# EAGLE design Sensor_Board_0x08_Dual_Temperatures_2xDS18B20_v1 (EAGLE 8.4.3)
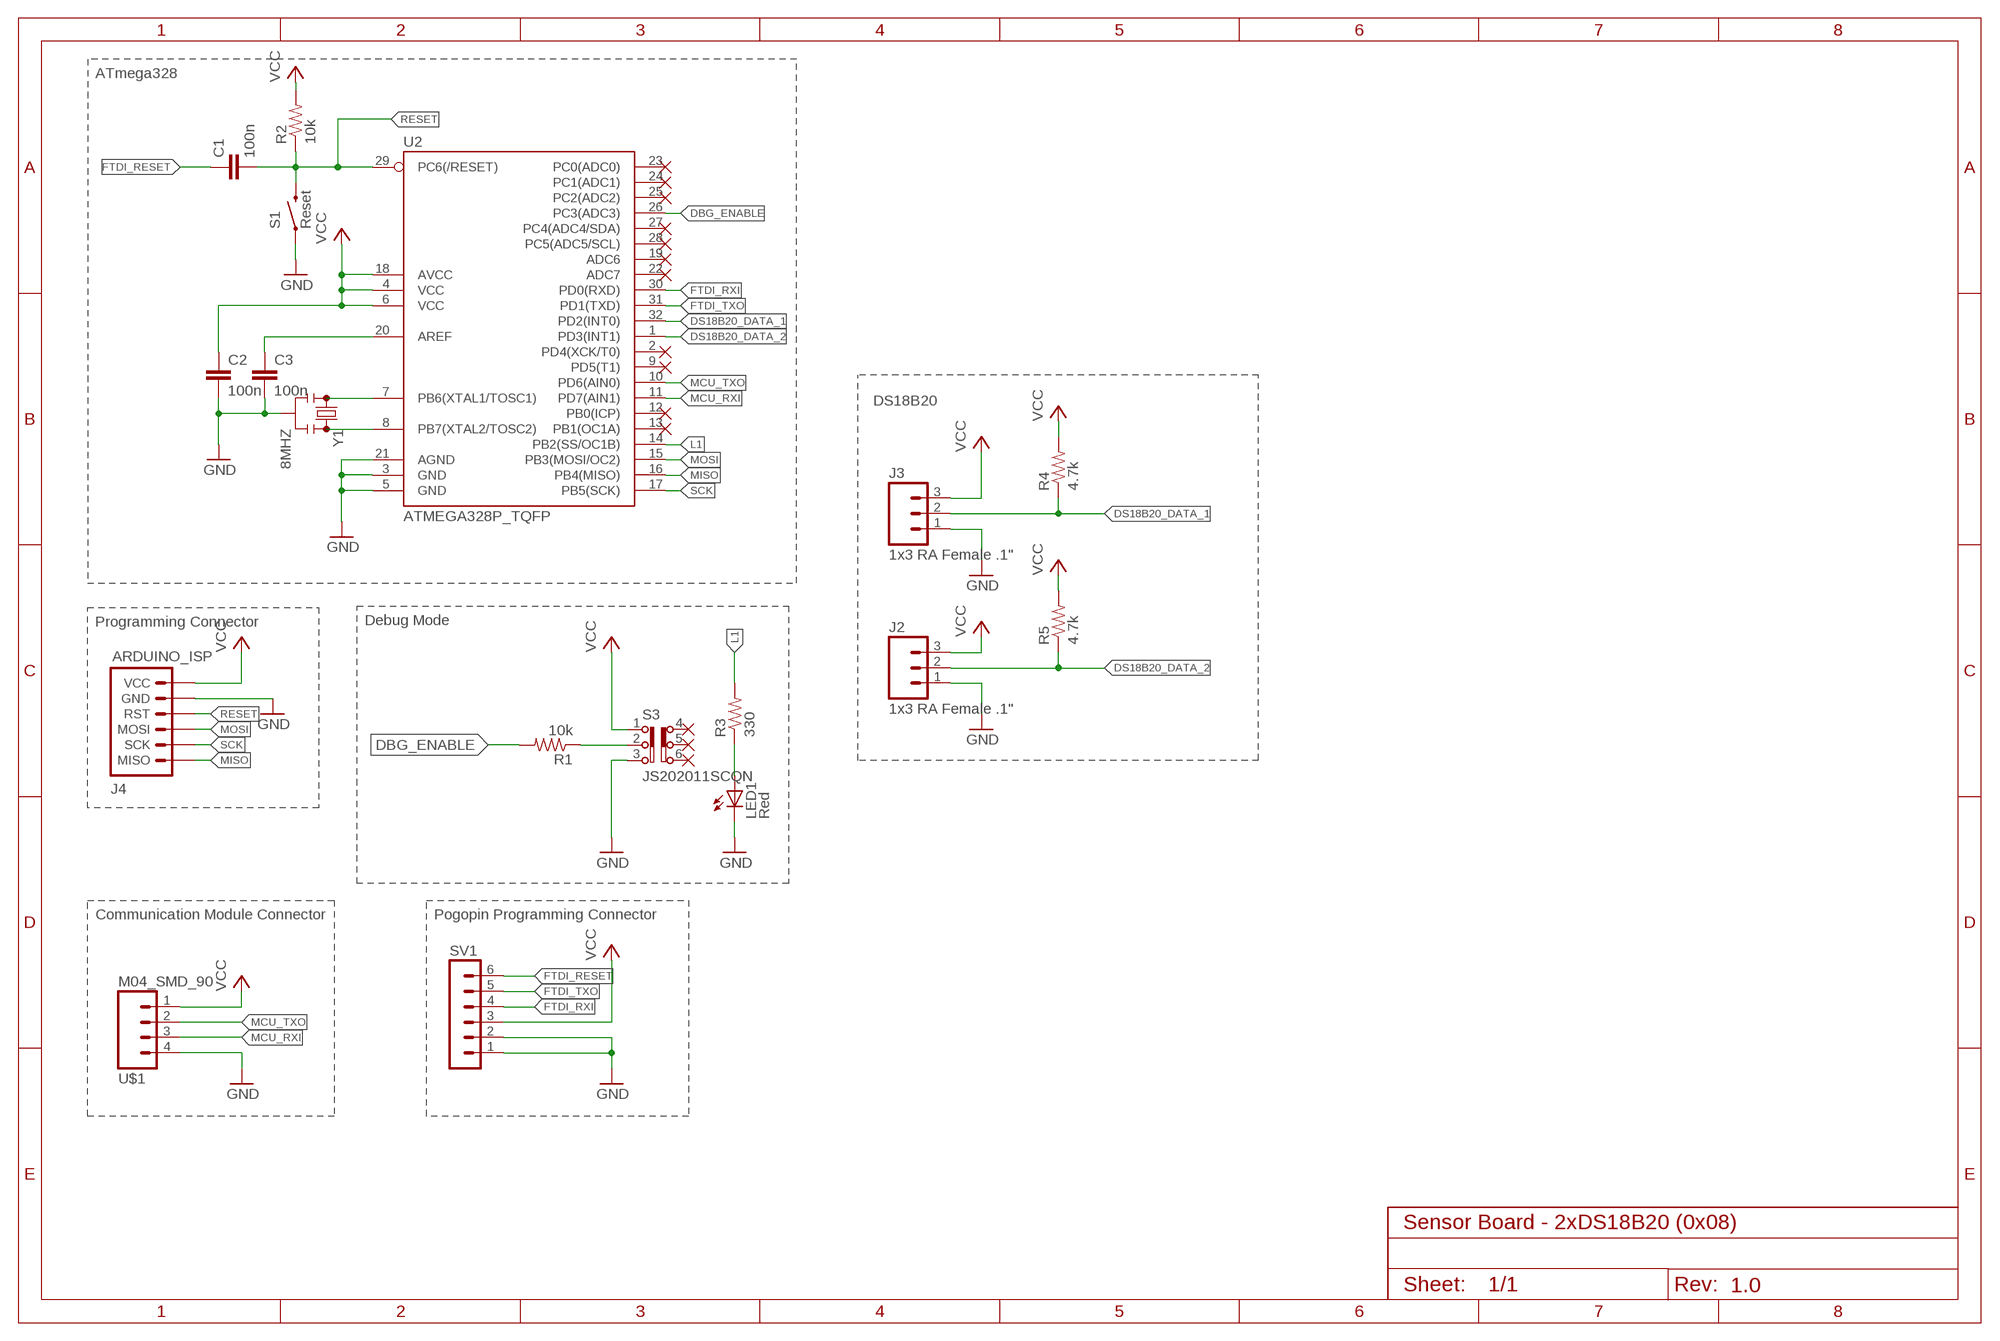
[diagram p0: schematic, sheet 1]
FRAME1 (FRAME-A4L): CNAME: Communication Module; CREVISION: 2.0

## Parts
C1  100n  C  [C0805]
C2  100n  C  [C0805]
C3  100n  C  [C0805]
J2  1x3 RA Female .1"  M03SMD_RA_FEMALE  [1X03_SMD_RA_FEMALE]
J3  1x3 RA Female .1"  M03SMD_RA_FEMALE  [1X03_SMD_RA_FEMALE]
J4  ARDUINO_ISP  [M-2X3]
LED1  Red  LEDSML0805  [SML0805]
R1  10k  RESISTOR0805-RES  [0805]
R2  10k  RESISTOR0805-RES  [0805]
R3  330  RESISTOR0805-RES  [0805]
R4  4.7k  RESISTOR0805-RES  [0805]
R5  4.7k  RESISTOR0805-RES  [0805]
S1  Reset  PUSHBUTTON  [M-PUSHBUTTON-SMD]
S3  JS202011SCQN  [JS202011SCQN]
SV1  MA06-1  [MA06-1]
U2  ATMEGA328P_TQFP  [TQFP32-08]
U$1  M04_SMD_90  [M04_SMD_90]
Y1  8MHZ  RESONATOR8MHZ  [RESONATOR-SMD]

## Nets
DBG_ENABLE: R1.2 U2.26(PC3(ADC3))
DS18B20_DATA_1: J3.2 R4.1 U2.32(PD2(INT0))
DS18B20_DATA_2: J2.2 R5.1 U2.1(PD3(INT1))
FTDI_RESET: C1.1 SV1.6
FTDI_RXI: SV1.4 U2.30(PD0(RXD))
FTDI_TXO: SV1.5 U2.31(PD1(TXD))
GND [GND]: C2.2 C3.2 J2.1 J3.1 J4.P$5(GND) LED1.C S1.1(LEFT) S1.2(LEFT) S3.3 SV1.1 SV1.2 U2.3(GND) U2.5(GND) U2.21(AGND) U$1.4 Y1.2
L1: R3.2 U2.14(PB2(SS/OC1B))
MCU_RXI: U2.11(PD7(AIN1)) U$1.3
MCU_TXO: U2.10(PD6(AIN0)) U$1.2
MISO: J4.P$1(MISO) U2.16(PB4(MISO))
MOSI: J4.P$3(MOSI) U2.15(PB3(MOSI/OC2))
N$1: U2.8(PB7(XTAL2/TOSC2)) Y1.3
N$2: U2.7(PB6(XTAL1/TOSC1)) Y1.1
N$3: R1.1 S3.2
N$15: C3.1 U2.20(AREF)
N$30: LED1.A R3.1
RESET: C1.2 J4.P$4(RST) R2.1 S1.3(RIGHT) S1.4(RIGHT) U2.29(PC6(/RESET))
SCK: J4.P$2(SCK) U2.17(PB5(SCK))
VCC [Vsupply]: C2.1 J2.3 J3.3 J4.P$6(VCC) R2.2 R4.2 R5.2 S3.1 SV1.3 U2.4(VCC) U2.6(VCC) U2.18(AVCC) U$1.1
Unconnected: S3.4 S3.5 S3.6 U2.2(PD4(XCK/T0)) U2.9(PD5(T1)) U2.12(PB0(ICP)) U2.13(PB1(OC1A)) U2.19(ADC6) U2.22(ADC7) U2.23(PC0(ADC0)) U2.24(PC1(ADC1)) U2.25(PC2(ADC2)) U2.27(PC4(ADC4/SDA)) U2.28(PC5(ADC5/SCL))

## Notes on the sheet
- ATmega328
- DS18B20
- Programming Connector | Debug Mode
- Communication Module Connector | Pogopin Programming Connector
- Sensor Board - 2xDS18B20 (0x08)
- 1.0

## Library data of the parts
C1-C3 = eagle-ltspice:C: CAPACITOR, European symbol; SPICEMODEL: NONE; SPICEPREFIX: C
J2 J3 = SparkFun-Connectors:M03: Header 3 Standard 3-pin 0.1" header. Use with straight break away headers (SKU : PRT-00116), right angle break away headers (PRT-00553), swiss pins (PRT-00743), machine pins (PRT-00117), and female headers (PRT-00115). Molex polarized connector foot print use with SKU : PRT-08232 with associated crimp pins and housings.; PROD_ID: CONN-10926
J4 = marc_library:ARDUINO_ISP: AVR ISP 6-pin inline header for Arduino ISP
LED1 = led:LED: LED OSRAM: - CHIPLED LG R971, LG N971, LY N971, LG Q971, LY Q971, LO R971, LY R971 LH N974, LH R974 LS Q976, LO Q976, LY Q976 LO Q996 - Hyper CHIPLED LW Q18S LB Q993, LB Q99A, LB R99A - SideLED LS A670, LO A670, LY A670, LG A670, LP A670 LB A673, LV A673, LT A673, LW A673 LH A674 LY A675 LS A676, LA A676, LO A676, LY A676, LW A676 LS A679, LY A679, LG A679 - Hyper Micro SIDELED® LS Y876, LA Y876, LO Y876, LY Y876 LT Y87S - SmartLED LW L88C, LW L88S LB L89C, LB L89S, LG L890 LS L89K, LO L89K, LY L89K LS L896, LA L896, LO L896, LY L896 - TOPLED LS T670, LO T670, LY T670, LG T670, LP T670 LSG T670, LSP T670, LSY T670, LOP T670, LYG T670 LG T671, LOG T671, LSG T671 LB T673, LV T673, LT T673, LW T673 LH T674 LS T676, LA T676, LO T676, LY T676, LB T676, LH T676, LSB T676, LW T676 LB T67C, LV T67C, LT T67C, LS T67K, LO T67K, LY T67K, LW E67C LS E67B, LA E67B, LO E67B, LY E67B, LB E67C, LV E67C, LT E67C LW T67C LS T679, LY T679, LG T679 LS T770, LO T770, LY T770, LG T770, LP T770 LB T773, LV T773, LT T773, LW T773 LH T774 LS E675, LA E675, LY E675, LS T675 LS T776, LA T776, LO T776, LY T776, LB T776 LHGB T686 LT T68C, LB T68C - Hyper Mini TOPLED® LB M676 - Mini TOPLED Santana® LG M470 LS M47K, LO M47K, LY M47K Source: http://www.osram.convergy.de LUXEON: - LUMILED® LXK2-PW12-R00, LXK2-PW12-S00, LXK2-PW14-U00, LXK2-PW14-V00 LXK2-PM12-R00, LXK2-PM12-S00, LXK2-PM14-U00 LXK2-PE12-Q00, LXK2-PE12-R00, LXK2-PE12-S00, LXK2-PE14-T00, LXK2-PE14-U00 LXK2-PB12-K00, LXK2-PB12-L00, LXK2-PB12-M00, LXK2-PB14-N00, LXK2-PB14-P00, LXK2-PB14-Q00 LXK2-PR12-L00, LXK2-PR12-M00, LXK2-PR14-Q00, LXK2-PR14-R00 LXK2-PD12-Q00, LXK2-PD12-R00, LXK2-PD12-S00 LXK2-PH12-R00, LXK2-PH12-S00 LXK2-PL12-P00, LXK2-PL12-Q00, LXK2-PL12-R00 Source: www.luxeon.com KINGBRIGHT: KA-3528ASYC Source: www.kingbright.com
R1-R5 = SparkFun-Passives:RESISTOR: Resistor Basic schematic elements and footprints for 0603, 1206, and PTH resistors.
S1 = marc_library:PUSHBUTTON
S3 = myownthings:JS202011SCQN: DPDT SLIDE SWITCH
SV1 = con-lstb:MA06-1: PIN HEADER; OC_FARNELL: unknown; OC_NEWARK: unknown
U2 = marc_library:ATMEGA328P_TQFP; PROD_ID: IC-09069
U$1 = myownthings:M04_SMD_90
Y1 = marc_library:RESONATOR: Resonator Small SMD resonator. Used, eg, on the Arduino Pro/ Pro Mini boards. 8MHz- XTAL-08895 16MHz- XTAL-08900; PROD_ID: XTAL-08895

## Net classes
0 default: width 0.3 mm
1 Vsupply: width 0.5 mm
5 GND: width 0.5 mm

## Board
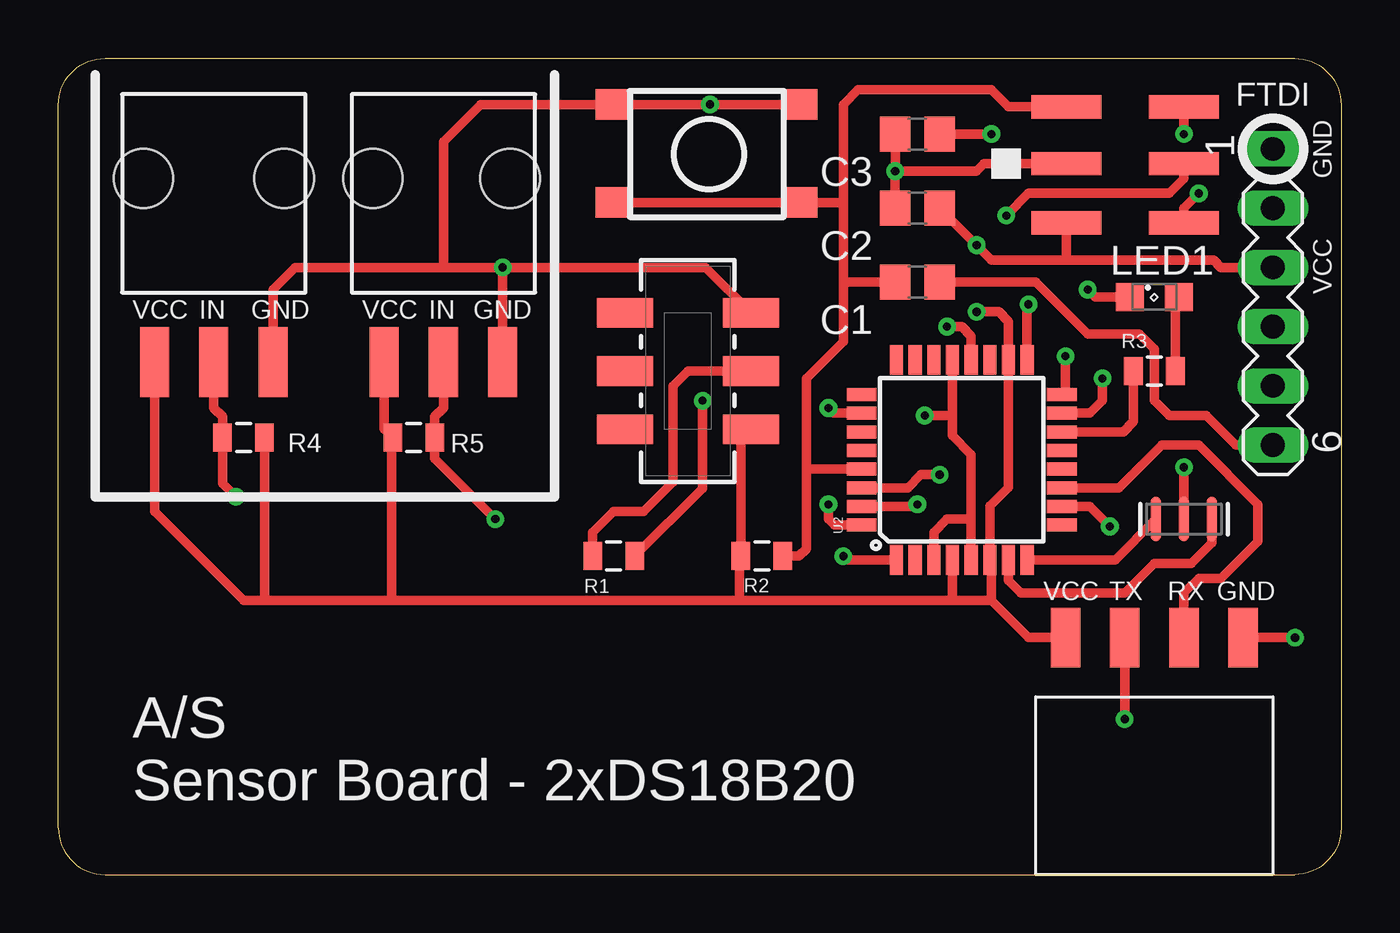
[diagram p1: board, top side]
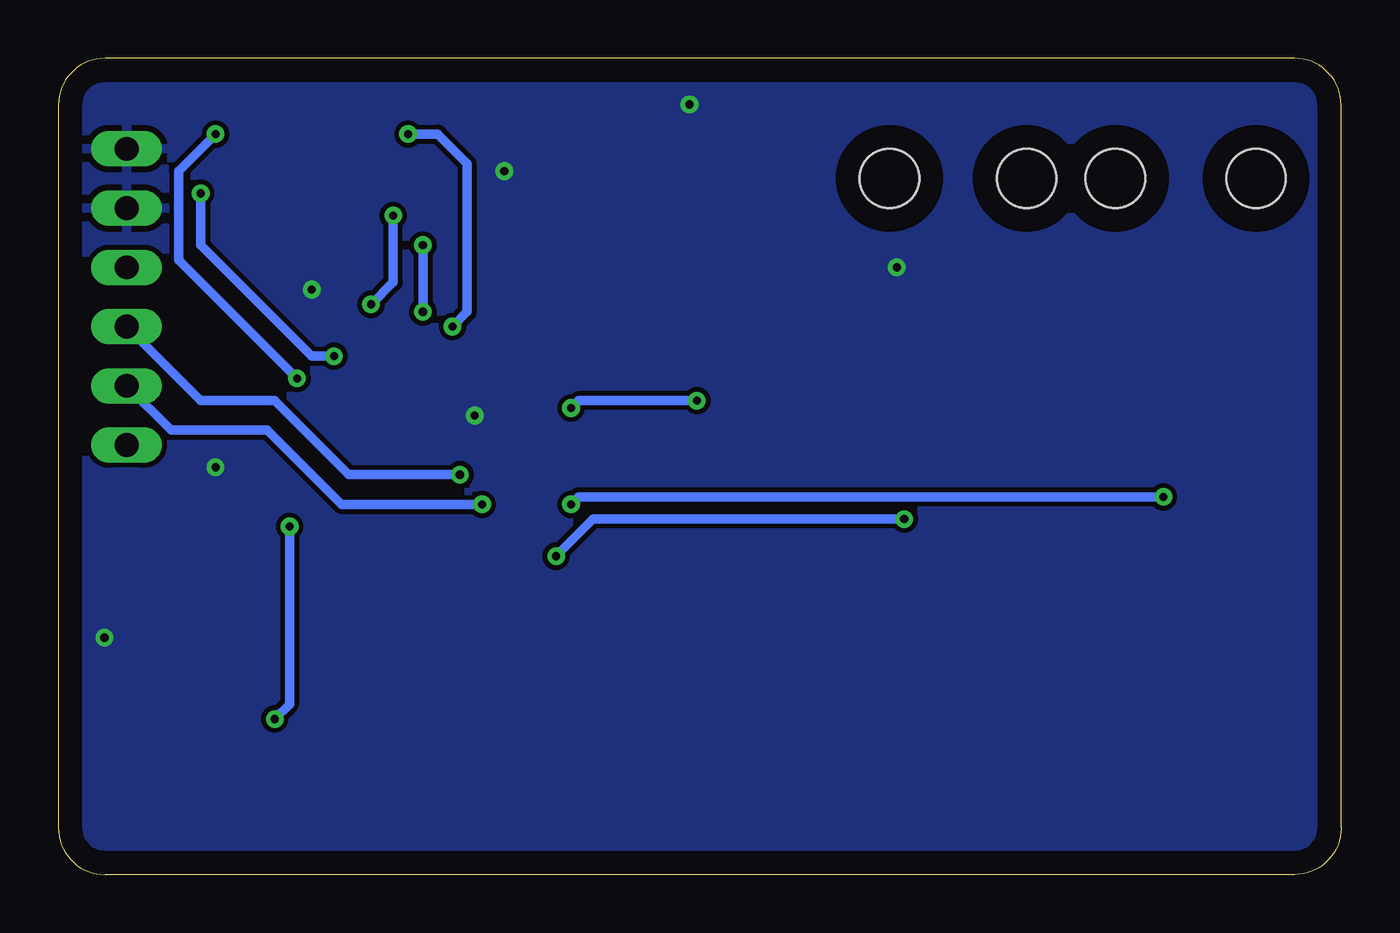
[diagram p2: board, bottom side, seen from below]

Size 55 x 35 mm. Coordinates in mm from the lower left corner, seen from the top.
Outline: 55,33 55,2 arc-90 53,0 2,0 arc-90 0,2 0,33 arc-90 2,35 53,35 arc-90 55,33
Copper layers (1*16): Top 0.035mm / dielectric 1.5mm / Bottom 0.035mm
Design rules "default *": minimum track width 10mil, minimum drill 24mil, track to track 8mil, track to pad 8mil, pad to pad 8mil, via to via 8mil, smd to smd 8mil, copper to edge 40mil, drill to drill 8mil, minimum pad ring 10mil, minimum via ring 8mil, stop-mask expansion 4mil, vias tented up to drill 0mil, thermal gap 10mil
Holes 2.54 mm at 19.37,29.84 9.68,29.84 3.65,29.84 13.49,29.84

### Footprints (pad centres in the part's own frame; a part is rotated, then mirrored left to right if it is on the bottom)
C0805 = smd 1.3 x 1.5: 1 -0.95,0; 2 0.95,0
1X03_SMD_RA_FEMALE = smd 1.25 x 3: 1 -2.54,7.225; 2 0,7.225; 3 2.54,7.225
M-2X3 = smd 1 x 3: P$1 0,0; P$2 2.54,0; P$3 4.98,0; P$4 4.98,5.05; P$5 2.54,5.05; P$6 0,5.05
SML0805 = smd 1.2 x 1.2: A 1.05,0; C -1.05,0
0805 = smd 0.8 x 1.2: 1 -0.9,0; 2 0.9,0
M-PUSHBUTTON-SMD = smd 1.55 x 1.3: 1 0,0; 2 7.95,0; 3 0,-4.2; 4 7.95,-4.2
JS202011SCQN = smd 1.27 x 2.4: 1 -2.5,-2.7; 2 0,-2.7; 3 2.5,-2.7; 4 -2.5,2.7; 5 0,2.7; 6 2.5,2.7
MA06-1 = drill 1.016 long: 1 -6.35,0; 2 -3.81,0; 3 -1.27,0; 4 1.27,0; 5 3.81,0; 6 6.35,0
TQFP32-08 = smd 1.27 x 0.559: 1 -4.293,2.8; 2 -4.293,2; 3 -4.293,1.2; 4 -4.293,0.4; 5 -4.293,-0.4; 6 -4.293,-1.2; 7 -4.293,-2; 8 -4.293,-2.8; 17 4.293,-2.8; 18 4.293,-2; 19 4.293,-1.2; 20 4.293,-0.4; 21 4.293,0.4; 22 4.293,1.2; 23 4.293,2; 24 4.293,2.8 | smd 0.559 x 1.27: 9 -2.8,-4.293; 10 -2,-4.293; 11 -1.2,-4.293; 12 -0.4,-4.293; 13 0.4,-4.293; 14 1.2,-4.293; 15 2,-4.293; 16 2.8,-4.293; 25 2.8,4.293; 26 2,4.293; 27 1.2,4.293; 28 0.4,4.293; 29 -0.4,4.293; 30 -1.2,4.293; 31 -2,4.293; 32 -2.8,4.293
M04_SMD_90 = smd 1.27 x 2.54: 1 0,0; 2 2.54,0; 3 5.08,0; 4 7.62,0
RESONATOR-SMD = smd 0.45 x 1.905: 1 -1.2,0; 2 0,0; 3 1.2,0

### Placement (x,y rotation side)
C1  36.83,25.4 180 top
C2  36.83,28.57 180 top
C3  36.83,31.75 180 top
J2  16.51,29.21 180 top
J3  6.67,29.21 180 top
J4  48.26,27.94 90 top
LED1  46.99,24.77 0 top
R1  23.81,13.65 0 top
R2  30.16,13.65 180 top
R3  46.99,21.59 180 top
R4  7.94,18.73 0 top
R5  15.24,18.73 180 top
S1  23.81,33.02 0 top
S3  26.99,21.59 90 top
SV1  52.07,24.77 270 top
U2  38.73,17.78 90 top
U$1  43.18,10.16 0 top
Y1  48.26,15.24 180 top

### Tracks (layer width: path | path; a pad name or v marks a point on that pad's centre or on a via)
DBG_ENABLE  (via drill 0.35)
  Top 0.406: R1.2 27.62,16.56 v27.62,20.32 | U2.26 33.24,19.78 v33.02,20
  Bottom 0.406: v27.62,20.32 32.7,20.32 v33.02,20
DS18B20_DATA_1  (via drill 0.35)
  Top 0.406: v7.62,16.19 7.04,16.77 R4.1 7.04,19.63 6.67,20 J3.2 | U2.32 33.28,14.98 33.02,15.24 v33.02,15.88
  Bottom 0.406: v7.62,16.19 32.7,16.19 v33.02,15.88
DS18B20_DATA_2  (via drill 0.35)
  Top 0.406: v18.73,15.24 16.14,17.83 R5.1 16.14,19.63 16.51,20 J2.2 | v33.66,13.65 33.82,13.49 U2.1
  Bottom 0.406: v18.73,15.24 32.07,15.24 v33.66,13.65
FTDI_RESET
  Top 0.406: C1.1 41.91,25.4 44.13,23.18 46.35,23.18 46.99,22.54 46.99,20.32 47.62,19.68 49.21,19.68 50.48,18.41 SV1.6
FTDI_RXI  (via drill 0.35)
  Top 0.406: U2.30 36.42,16.58 36.99,17.14 v37.78,17.14
  Bottom 0.406: SV1.4 48.9,20.32 45.72,20.32 42.55,17.14 v37.78,17.14
FTDI_TXO  (via drill 0.35)
  Top 0.406: U2.31 36.73,15.78 v36.83,15.88
  Bottom 0.406: SV1.5 50.16,19.05 46.04,19.05 42.86,15.88 v36.83,15.88
GND  (via drill 0.35)
  Top 0.406: Y1.2 v48.26,17.46 | v53.02,10.16 U$1.4 | S1.2 v27.94,33.02 S1.1 18.1,33.02 16.51,31.43 16.51,26.04 | J3.1 9.21,25.08 10.16,26.04 16.51,26.04 | J4.P$5 39.69,30.48 39.37,30.16 v35.88,30.16 | v44.13,25.08 44.45,24.77 LED1.C | 38.34,19.68 38.34,18.82 39.13,18.02 39.13,15.24 | 38.34,19.68 U2.21 | 39.13,15.24 U2.5 | U2.3 37.53,14.68 38.1,15.24 39.13,15.24 | 38.34,19.68 v37.15,19.68 | S3.3 27.74,26.04 v19.05,26.04 | 16.51,26.04 v19.05,26.04 | v19.05,26.04 J2.1 | C3.2 v35.88,30.16 | v35.88,30.16 C2.2
  pour Bottom: 55,33 55,2 arc-90 53,0 2,0 arc-90 0,2 0,33 arc-90 2,35 53,35 arc-90
L1
  Top 0.406: R3.2 46.09,19.42 45.65,18.98 U2.14
MCU_RXI
  Top 0.406: U2.11 45.47,16.58 47.31,18.41 48.9,18.41 51.44,15.88 51.44,14.29 49.85,12.7 48.9,12.7 48.26,12.06 U$1.3
MCU_TXO  (via drill 0.35)
  Top 0.406: U2.10 44.23,15.78 v45.09,14.92 | v45.72,6.67 U$1.2
  Bottom 0.406: v45.09,14.92 45.09,7.3 v45.72,6.67
MISO  (via drill 0.35)
  Top 0.406: U2.16 43.18,20.73 v43.18,22.23 | v48.9,29.21 48.26,28.57 J4.P$1
  Bottom 0.406: v48.9,29.21 48.9,26.99 44.13,22.23 v43.18,22.23
MOSI  (via drill 0.35)
  Top 0.406: J4.P$3 v48.26,31.75 | v44.77,21.27 44.77,20.32 44.23,19.78 U2.15
  Bottom 0.406: v48.26,31.75 49.85,30.16 49.85,26.35 v44.77,21.27
N$1
  Top 0.406: Y1.3 45.31,13.49 U2.8
N$2
  Top 0.406: Y1.1 49.46,14.22 48.58,13.34 46.99,13.34 45.72,12.06 41.27,12.06 40.73,12.61 U2.7
N$3
  Top 0.406: R1.1 22.91,14.66 23.81,15.56 25.08,15.56 26.35,16.83 26.35,20.95 26.99,21.59 S3.2
N$15  (via drill 0.35)
  Top 0.406: C3.1 v40.01,31.75 | U2.20 39.13,23.09 38.73,23.5 v38.1,23.5
  Bottom 0.406: v40.01,31.75 38.73,31.75 37.47,30.48 37.47,24.13 v38.1,23.5
N$30
  Top 0.406: R3.1 47.89,24.61 LED1.A
RESET
  Top 0.406: J4.P$4 40.74,32.92 40.01,33.66 34.29,33.66 33.66,33.02 33.66,28.89 | 33.66,28.89 33.66,25.4 | 33.66,25.4 33.66,22.86 32.07,21.27 32.07,17.46 | C1.2 33.66,25.4 | S1.3 S1.4 33.58,28.82 33.66,28.89 | R2.1 31.75,13.65 32.07,13.97 32.07,17.46 | U2.29 32.15,17.38 32.07,17.46
SCK  (via drill 0.35)
  Top 0.406: U2.17 41.53,24.39 v41.59,24.45 | v40.64,28.26 41.59,29.21 47.62,29.21 48.26,29.84 J4.P$2
  Bottom 0.406: v41.59,24.45 40.64,25.4 v40.64,28.26
VCC  (via drill 0.35)
  Top 0.406: 43.18,26.35 40,26.35 v39.37,26.98 v39.37,26.99 C2.1 | 43.18,26.35 49.53,26.35 49.85,26.04 SV1.3 | J4.P$6 43.21,26.38 43.18,26.35 | v39.37,24.13 40.32,24.13 40.73,23.72 U2.18 40.73,16.61 39.94,15.8 U2.6 40.01,13.42 40.01,11.75 | U$1.1 41.59,10.16 40.01,11.75 | 29.21,11.75 14.29,11.75 | 38.42,11.75 29.21,11.75 | 38.42,11.75 40.01,11.75 | 14.29,11.75 14.29,18.68 R5.2 13.97,19.1 J2.3 | 29.21,11.75 29.21,13.6 R2.2 29.26,18.66 S3.1 | J3.3 4.13,15.56 7.94,11.75 8.89,11.75 | 8.89,11.75 14.29,11.75 | R4.2 8.84,11.8 8.89,11.75 | U2.4 38.34,11.83 38.42,11.75
  Bottom 0.406: v39.37,26.99 v39.37,24.13

### Text on the board
tPlace: FTDI | GND | VCC | VCC | IN | GND | VCC | IN | GND | VCC | TX | RX | GND | A/S / Sensor Board - 2xDS18B20